# EAGLE design Power_Board_v2 (EAGLE 7.1.0)
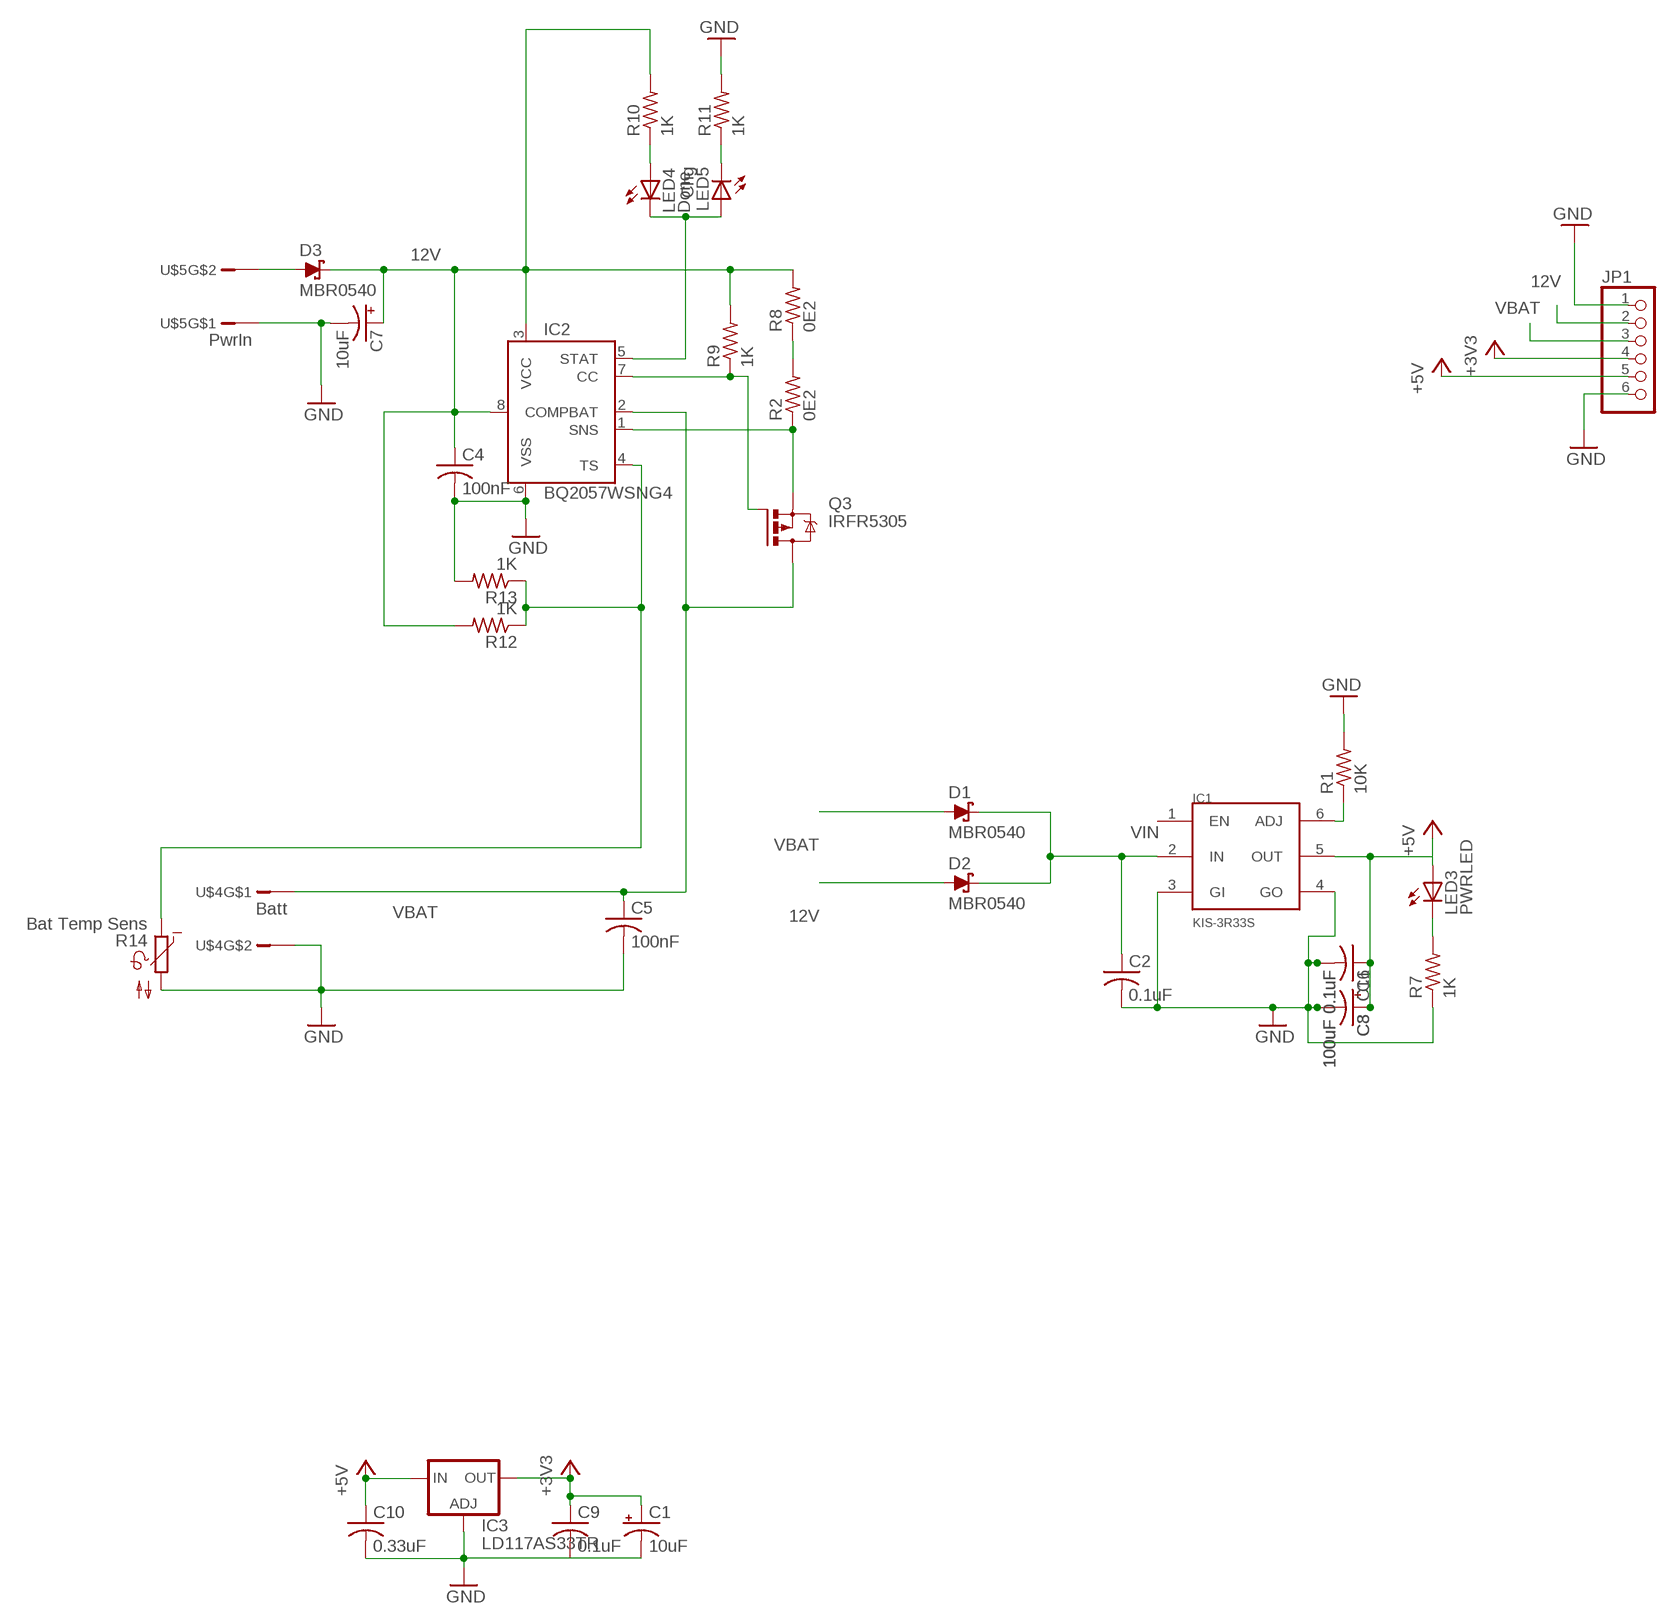
[diagram p0: schematic, sheet 1]

## Parts
C1  10uF  CPOL-US153CLV-0405  [153CLV-0405]
C2  0.1uF  C-USC0805K  [C0805K]
C3  100uF  CPOL-USD  [PANASONIC_D]
C4  100nF  C-USC0805K  [C0805K]
C5  100nF  C-USC0805K  [C0805K]
C6  0.1uF  C-USC0805K  [C0805K]
C7  10uF  CPOL-US153CLV-0405  [153CLV-0405]
C8  100uF  CPOL-USD  [PANASONIC_D]
C9  0.1uF  C-USC0805K  [C0805K]
C10  0.33uF  C-USC0805K  [C0805K]
C11  0.1uF  C-USC0805K  [C0805K]
D1  MBR0540  [SOD123]
D2  MBR0540  [SOD123]
D3  MBR0540  [SOD123]
IC1  KIS-3R33S  [KIS-3R33S]
IC2  BQ2057WSNG4  [D_R-PDSO-G8]
IC3  LD117AS33TR  [SOT223]
JP1  PINHD-1X6  [1X06]
LED3  PWRLED  LEDCHIPLED_0805  [CHIPLED_0805]
LED4  Done  LEDCHIPLED_0805  [CHIPLED_0805]
LED5  Chg  LEDCHIPLED_0805  [CHIPLED_0805]
Q3  IRFR5305  [D-PAK_TO252AA]
R1  10K  R-US_R0805  [R0805]
R2  0E2  R-US_M1206  [M1206]
R7  1K  R-US_R0805  [R0805]
R8  0E2  R-US_M1206  [M1206]
R9  1K  R-US_R0805  [R0805]
R10  1K  R-US_R0805  [R0805]
R11  1K  R-US_R0805  [R0805]
R12  1K  R-US_R0805  [R0805]
R13  1K  R-US_R0805  [R0805]
R14  Bat Temp Sens  NTC640  [P640]
U$4  Batt  JST_PHR-2  [PHR-2]
U$5  PwrIn  JST_PHR-2  [PHR-2]

## Nets
12V: C4.1 C7.+ D2.A D3.C IC2.3(VCC) IC2.8(COMP) JP1.2 R8.2 R9.2 R10.2 R12.2
+3V3: C1.+ C9.1 IC3.4(OUT) JP1.4
+5V: C3.+ C6.1 C8.+ C10.1 C11.1 IC1.5(OUT) IC3.3(IN) JP1.5 LED3.A
GND: C1.- C2.2 C3.- C4.2 C5.2 C6.2 C7.- C8.- C9.2 C10.2 C11.2 IC1.3(GI) IC1.4(GO) IC2.6(VSS) IC3.1(ADJ) JP1.1 JP1.6 R1.2 R7.1 R11.2 R13.2 R14.2 U$4.P$2 U$5.P$1
N$1: R2.2 R8.1
N$2: IC1.6(ADJ) R1.1
N$6: LED3.C R7.2
N$8: IC2.5(STAT) LED4.C LED5.A
N$11: LED4.A R10.1
N$17: D3.A U$5.P$2
N$27: IC2.1(SNS) Q3.3(S) R2.1
N$29: IC2.7(CC) Q3.1(G) R9.1
N$30: LED5.C R11.1
N$32: IC2.4(TS) R12.1 R13.1 R14.1
VBAT: C5.1 D1.A IC2.2(BAT) JP1.3 Q3.4(D) U$4.P$1
VIN: C2.1 D1.C D2.C IC1.2(IN)
Unconnected: IC1.1(EN)

## Library data of the parts
C1 C3 C7 C8 = resistor:CPOL-US: POLARIZED CAPACITOR, American symbol
C2 C4-C6 C9-C11 = resistor:C-US: CAPACITOR, American symbol
D1-D3 = diode:MBR0540: schottky diode, 0.5A, 40V ON Semiconductor
IC1 = KIS-3R33S:KIS-3R33S: DC-DC Converter
IC2 = RobThePyro:BQ2057WSNG4: TI BQ2057WSNG4 1-2Cell Li-ion / lipo charger IC http://www.ti.com/lit/ds/symlink/bq2057w.pdf
IC3 = v-reg:LD117A?*: Low drop fixed and adjustable positive voltage regulators 1 A Source: http://www.st.com/stonline/products/literature/ds/7194/ld1117axx.pdf
JP1 = pinhead:PINHD-1X6: PIN HEADER
LED3-LED5 = led:LED: LED OSRAM: - CHIPLED LG R971, LG N971, LY N971, LG Q971, LY Q971, LO R971, LY R971 LH N974, LH R974 LS Q976, LO Q976, LY Q976 LO Q996 - Hyper CHIPLED LW Q18S LB Q993, LB Q99A, LB R99A - SideLED LS A670, LO A670, LY A670, LG A670, LP A670 LB A673, LV A673, LT A673, LW A673 LH A674 LY A675 LS A676, LA A676, LO A676, LY A676, LW A676 LS A679, LY A679, LG A679 - Hyper Micro SIDELED® LS Y876, LA Y876, LO Y876, LY Y876 LT Y87S - SmartLED LW L88C, LW L88S LB L89C, LB L89S, LG L890 LS L89K, LO L89K, LY L89K LS L896, LA L896, LO L896, LY L896 - TOPLED LS T670, LO T670, LY T670, LG T670, LP T670 LSG T670, LSP T670, LSY T670, LOP T670, LYG T670 LG T671, LOG T671, LSG T671 LB T673, LV T673, LT T673, LW T673 LH T674 LS T676, LA T676, LO T676, LY T676, LB T676, LH T676, LSB T676, LW T676 LB T67C, LV T67C, LT T67C, LS T67K, LO T67K, LY T67K, LW E67C LS E67B, LA E67B, LO E67B, LY E67B, LB E67C, LV E67C, LT E67C LW T67C LS T679, LY T679, LG T679 LS T770, LO T770, LY T770, LG T770, LP T770 LB T773, LV T773, LT T773, LW T773 LH T774 LS E675, LA E675, LY E675, LS T675 LS T776, LA T776, LO T776, LY T776, LB T776 LHGB T686 LT T68C, LB T68C - Hyper Mini TOPLED® LB M676 - Mini TOPLED Santana® LG M470 LS M47K, LO M47K, LY M47K Source: http://www.osram.convergy.de LUXEON: - LUMILED® LXK2-PW12-R00, LXK2-PW12-S00, LXK2-PW14-U00, LXK2-PW14-V00 LXK2-PM12-R00, LXK2-PM12-S00, LXK2-PM14-U00 LXK2-PE12-Q00, LXK2-PE12-R00, LXK2-PE12-S00, LXK2-PE14-T00, LXK2-PE14-U00 LXK2-PB12-K00, LXK2-PB12-L00, LXK2-PB12-M00, LXK2-PB14-N00, LXK2-PB14-P00, LXK2-PB14-Q00 LXK2-PR12-L00, LXK2-PR12-M00, LXK2-PR14-Q00, LXK2-PR14-R00 LXK2-PD12-Q00, LXK2-PD12-R00, LXK2-PD12-S00 LXK2-PH12-R00, LXK2-PH12-S00 LXK2-PL12-P00, LXK2-PL12-Q00, LXK2-PL12-R00 Source: www.luxeon.com KINGBRIGHT: KA-3528ASYC Source: www.kingbright.com
Q3 = transistor-power:IRF?5305: HEXFET Power MOSFET Source: http://www.irf.com/product-info/datasheets/data/irfr5305pbf.pdf
R1 R2 R7-R13 = resistor:R-US_: RESISTOR, American symbol
R14 = ptc-ntc:NTC640: PHILIPS NTC; OC_FARNELL: unknown; OC_NEWARK: unknown
U$4 U$5 = RobThePyro:JST_PHR-2

## Net classes
0 default: width 0.152 mm, drill 0.305 mm, clearance 0.152 mm

## Board
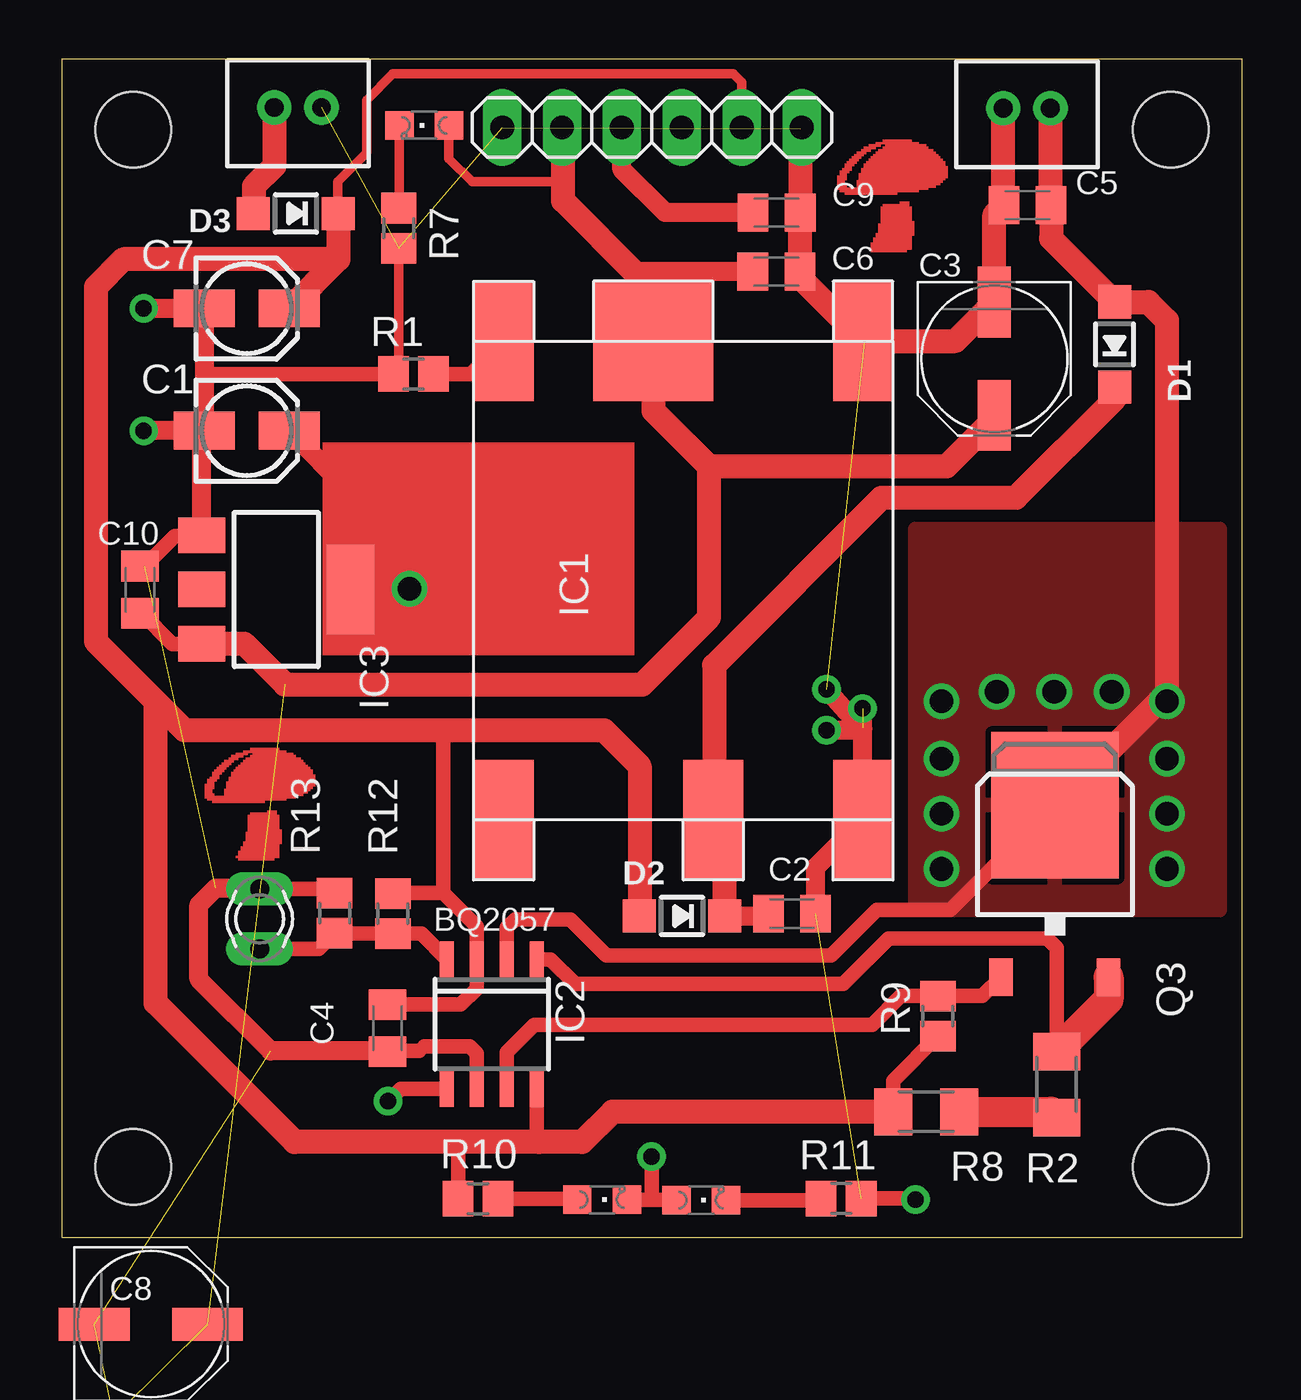
[diagram p1: board, top side]
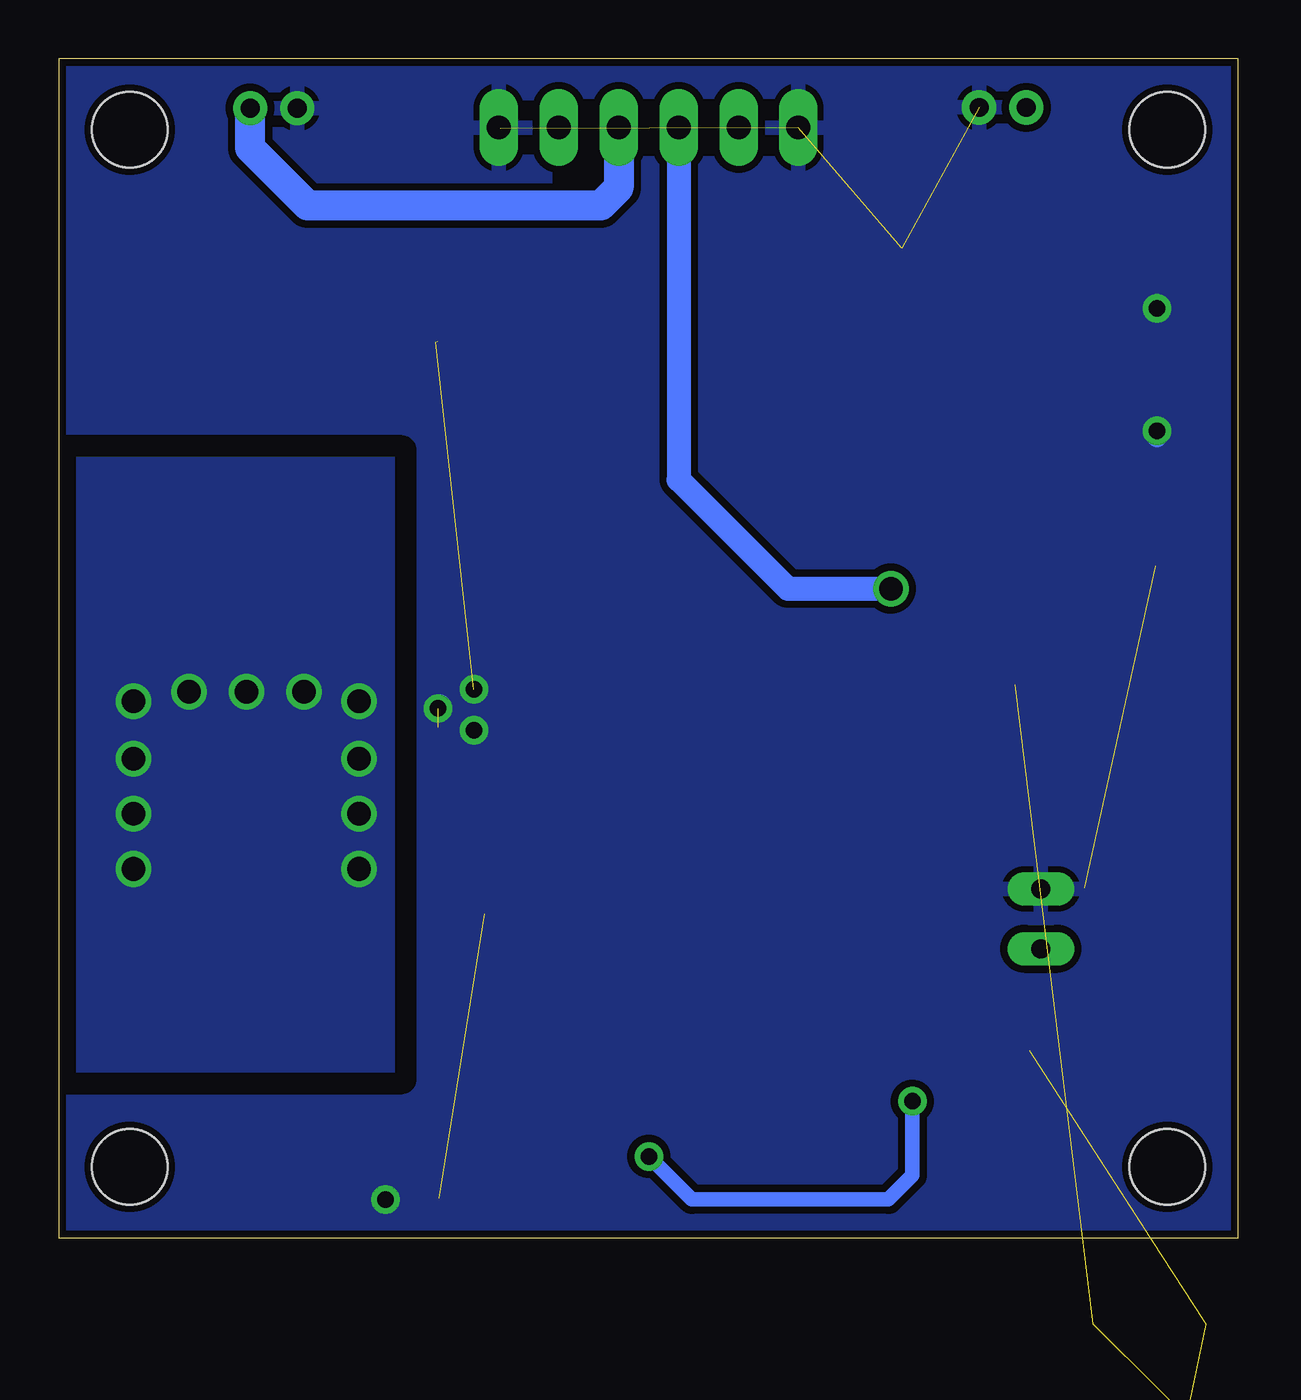
[diagram p2: board, bottom side, seen from below]

Size 50 x 50 mm. Coordinates in mm from the lower left corner, seen from the top.
Outline: 0,0 0,50 50,50 50,0 0,0
Copper layers (1*16): Top 0.035mm / dielectric 1.5mm / Bottom 0.035mm
Design rules "SparkFun": minimum track width 8mil, minimum drill 20mil, track to track 8mil, track to pad 8mil, pad to pad 8mil, via to via 8mil, smd to smd 8mil, copper to edge 10mil, drill to drill 8mil, minimum pad ring 12mil, minimum via ring 10mil, stop-mask expansion 4mil, vias tented up to drill 25mil, thermal gap 10mil
Holes 3.2 mm at 3,3 3,47 47,47 47,3
bRestrict: 4 lines

### Footprints (pad centres in the part's own frame; a part is rotated, then mirrored left to right if it is on the bottom)
153CLV-0405 = smd 2.6 x 1.6: + 1.8,0; - -1.8,0
C0805K = smd 1.3 x 1.6: 1 -1,0; 2 1,0
PANASONIC_D = smd 3 x 1.4: + 2.4,0; - -2.4,0
SOD123 = smd 1.4 x 1.4: A 1.805,0; C -1.805,0
KIS-3R33S = smd 5.08 x 2.54: 1 10.16,-7.62; 2 10.16,1.27; 3 10.16,7.62; 4 -10.16,7.62; 6 -10.16,-7.62 | smd 5.08 x 5.08: 5 -10.16,-1.27
D_R-PDSO-G8 = smd 0.6 x 1.5: 1 -1.905,-2.75; 2 -0.635,-2.75; 3 0.635,-2.75; 4 1.905,-2.75; 5 1.905,2.75; 6 0.635,2.75; 7 -0.635,2.75; 8 -1.905,2.75
SOT223 = smd 1.5 x 2: 1 -2.3,-3.15; 2 0,-3.15; 3 2.3,-3.15 | smd 3.8 x 2: 4 0,3.15
1X06 = drill 1.016 long: 1 -6.35,0; 2 -3.81,0; 3 -1.27,0; 4 1.27,0; 5 3.81,0; 6 6.35,0
CHIPLED_0805 = smd 1.2 x 1.2: A 0,-1.05; C 0,1.05
D-PAK_TO252AA = smd 1 x 1.6: 1 -2.28,-4.8; 3 2.28,-4.8 | smd 5.4 x 6.2: 4 0,2.5
R0805 = smd 1.3 x 1.5: 1 -0.85,0; 2 0.85,0
M1206 = smd 1.6 x 2: 1 -1.4,0; 2 1.4,0
P640 = drill 0.813 long: 1 -1.27,0; 2 1.27,0
PHR-2 = drill 0.8 pad 1.45: P$1 1,0; P$2 -1,0

### Placement (x,y rotation side)
C1  7.82,34.23 0 top
C2  30.94,13.74 0 top
C3  39.52,37.28 270 top
C4  13.79,8.89 270 top
C5  40.92,43.8 180 top
C6  30.27,40.98 0 top
C7  7.82,39.41 0 top
C8  3.75,-3.66 0 top  (outside the outline)
C9  30.28,43.48 0 top
C10  3.29,27.49 90 top
C11  1.52,-9.25 0 top  (outside the outline)
D1  44.61,37.89 90 top
D2  26.27,13.65 180 top
D3  9.9,43.45 180 top
IC1  26.33,27.87 270 top
IC2  18.21,9.06 180 top
IC3  9.06,27.5 270 top
JP1  24.99,47.09 180 top
LED3  15.34,47.18 90 top
LED4  22.88,1.61 270 top
LED5  27.08,1.59 270 top
Q3  42.09,15.85 0 top
R1  14.89,36.64 180 top
R2  42.16,6.5 270 top
R7  14.26,42.82 90 top
R8  36.63,5.34 180 top
R9  37.12,9.4 270 top
R10  17.62,1.66 180 top
R11  33.02,1.67 0 top
R12  14.01,13.75 90 top
R13  11.54,13.77 90 top
R14  8.36,13.52 90 top
U$4  40.89,47.91 0 top
U$5  9.98,47.94 0 top

### Tracks (layer width: path | path; a pad name or v marks a point on that pad's centre or on a via)
12V
  Top 0.406: JP1.2 28.8,49.01 28.44,49.37 14.01,49.37 12.9,48.25 12.9,46.02 11.68,44.8 11.68,43.47 D3.C
  Top 0.61: C4.1 16.9,9.89 17.57,10.56 IC2.3 17.57,13.2 16.15,14.62 | IC2.8 20.11,4.16 20.21,4.06 | R10.2 16.77,3.94 16.66,4.06 | 16.15,14.62 14.04,14.62 R12.2 | 16.15,14.62 16.15,21.33 15.94,21.53 | R8.2 35.23,6.66 R9.2
  Top 1.016: D3.C 11.7,41.5 | 11.7,41.5 C7.+ | 11.7,41.5 2.59,41.5 1.42,40.33 1.42,25.29 3.96,22.75 | R8.2 23.33,5.34 22.04,4.06 20.21,4.06 16.66,4.06 9.85,4.06 3.96,9.95 3.96,22.75 | 3.96,22.75 5.18,21.53 15.94,21.53 22.96,21.53 24.48,20.01 24.48,13.46 D2.A
+3V3  (via drill 1)
  Top 0.813: IC3.4 12.21,31.64 C1.+ | C9.1 25.55,43.48 23.72,45.31 JP1.4
  Top 1.016: v14.73,27.53 12.25,27.53 IC3.4
  Bottom 1.016: JP1.4 23.72,32.16 19.09,27.53 v14.73,27.53
+5V  (2 unrouted)
  Top 0.406: LED3.A 16.39,45.77 17.37,44.8 21.02,44.8 21.23,44.6
  Top 0.61: C10.1 3.37,26.49 4.67,25.19 IC3.3
  Top 0.813: C6.1 24.52,40.98 24.38,40.84
  Top 1.016: JP1.5 21.23,47.05 21.23,44.6 21.23,43.99 24.38,40.84 25.06,40.16 IC1.5 25.06,35.08 27.43,32.71 | IC3.3 7.71,25.2 9.44,23.46 24.58,23.46 27.43,26.31 27.43,32.71 | C3.+ 39.52,34.74 37.48,32.71 27.43,32.71
GND  (via drill 0.7)  (10 unrouted)
  Top 0.406: R7.1 14.26,36.86 R1.2
  Top 0.61: C10.2 3.5,28.49 4.77,29.76 5.88,29.76 IC3.1 | IC2.6 17.57,7.81 17.27,8.12 15.34,8.12 15.13,7.92 13.82,7.92 C4.2 | R14.2 11.37,14.79 R13.2 | R11.2 36.12,1.67 v36.16,1.62 | R1.2 6.05,36.64 6.02,36.67
  Top 0.813: 6.02,34.84 6.02,36.67 C7.- v3.45,39.41 | 6.02,34.84 C1.- v3.45,34.23 | IC3.1 5.91,34.74 6.02,34.84 | 13.82,7.92 8.83,7.92 5.78,10.97 5.78,14.12 6.5,14.83 8.33,14.83 R14.2 | C2.2 31.94,15.7 IC1.3 33.95,22.43 v33.93,22.45 | v32.4,21.53 33.83,21.53 33.93,21.63 33.93,21.53 v32.4,23.26
  Top 1.016: IC1.4 37.87,38.03 C3.- 39.52,43.39 39.89,43.77 | 39.89,43.77 C5.2 | 39.89,43.77 U$4.P$2 | JP1.1 31.28,47.03 C9.2 31.28,41 C6.2 31.27,40.75 34.03,37.99
  Bottom 0.61: v36.16,1.62 36.47,1.62
  Bottom 0.813: v33.93,22.45 33.93,22.55 33.83,22.65 | v3.45,39.41 3.24,39.41 | v3.45,34.23 3.55,34.03 3.45,33.93
  pour Bottom (isolate 0.305): -0.01,49.99 -0.01,-0.01 49.99,-0.01 49.99,49.99
N$1
  Top 1.27: R8.1 41.91,5.34 R2.2
N$2
  Top 0.61: R1.1 17.31,36.64 IC1.6
N$6
  Top 0.406: LED3.C 14.29,43.7 R7.2
N$8  (via drill 0.7)
  Top 0.61: LED4.C 24.99,1.61 | 24.99,1.61 26.01,1.61 LED5.A | IC2.5 14.34,6.31 v13.81,5.78 | v24.99,3.45 24.99,1.61
  Bottom 0.61: v13.81,5.78 13.81,2.64 14.83,1.62 23.16,1.62 v24.99,3.45
N$11
  Top 0.61: R10.1 21.79,1.66 LED4.A
N$17
  Top 1.016: U$5.P$2 8.98,45.46 8.12,44.6 8.12,43.47 D3.A
N$27
  Top 0.61: IC2.1 20.69,11.81 21.74,10.76 33.12,10.76 35.05,12.69 41.75,12.69 42.16,12.29 R2.1
  Top 1.27: Q3.3 44.37,10.1 R2.1
N$29
  Top 0.61: 39.68,11.17 Q3.1 39.01,10.25 R9.1 35.55,10.26 34.33,9.04 20.01,9.04 18.84,7.87 IC2.7
N$30
  Top 0.61: LED5.C 32.1,1.59 R11.1
N$32
  Top 0.61: IC2.4 15.22,12.9 R12.1 11.56,12.9 R13.1 10.88,12.25 R14.1
VBAT  (via drill 1)
  Top 0.61: IC2.2 18.84,13.15 19.2,13.51 21.53,13.51 23.06,11.98 32.61,11.98 34.54,13.91 37.65,13.91 Q3.4
  Top 1.016: U$4.P$1 41.89,43.82 C5.1 41.92,42.39 D1.A 46.04,39.69 46.83,38.91 46.83,23.09 Q3.4
  Bottom 1.27: JP1.3 26.26,44.54 27.02,43.78 39.46,43.78 41.89,46.22 U$4.P$1
  other vias: 46.83,15.64 46.83,17.98 46.83,20.31 42.06,23.16 44.49,23.16 46.83,22.75 39.62,23.16 37.28,22.75 37.28,20.31 37.28,17.98 37.28,15.64
  pour Top: 42.06,13.91 49.07,13.91 49.07,30.07 36.16,30.07 36.16,13.91
  pour Bottom: 35.45,6.6 49.57,6.7 49.57,33.42 35.45,33.42
VIN
  Top 0.813: D2.C 29.84,13.65 C2.1
  Top 1.016: 27.63,17.68 IC1.2 28.08,17.23 28.08,16.96 | D2.C 28.08,16.96 | D1.C 44.61,35.57 40.43,31.39 34.74,31.39 27.63,24.28 27.63,17.41 28.08,16.96
(copper drawn outside any net)
  shapes: Top area x125

### Text on the board
tNames: BQ2057